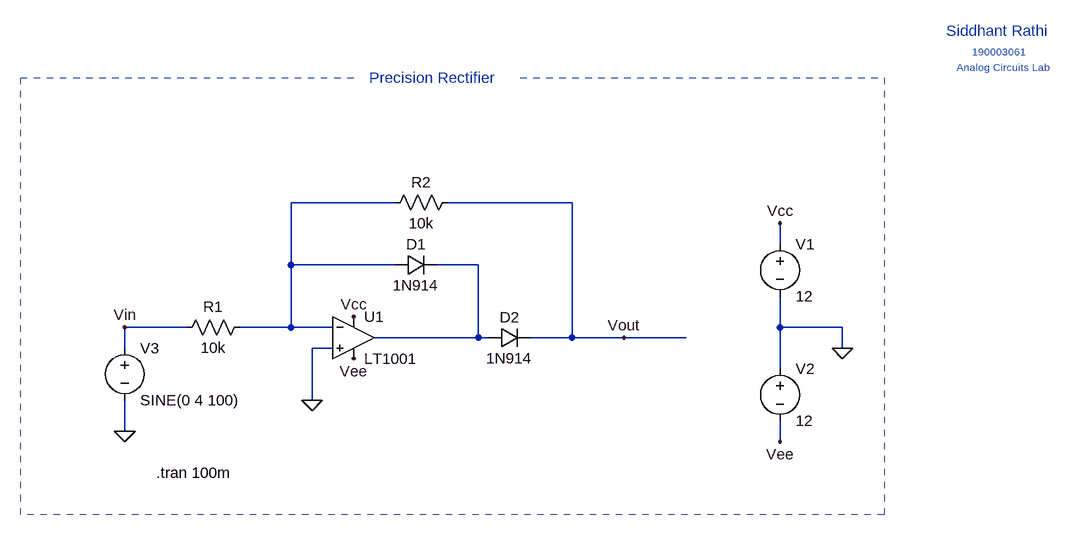
[diagram p0: schematic PrecisionRectifier.asc]
PrecisionRectifier.asc, the LTspice schematic file:
Version 4
SHEET 1 1780 680
WIRE 320 80 160 80
WIRE 592 80 400 80
WIRE 912 144 912 112
WIRE 160 176 160 80
WIRE 320 176 160 176
WIRE 448 176 384 176
WIRE 0 272 -96 272
WIRE 160 272 160 176
WIRE 160 272 80 272
WIRE 224 272 160 272
WIRE 912 272 912 224
WIRE 1008 272 912 272
WIRE 448 288 448 176
WIRE 448 288 288 288
WIRE 464 288 448 288
WIRE 592 288 592 80
WIRE 592 288 528 288
WIRE 672 288 592 288
WIRE 768 288 672 288
WIRE -96 304 -96 272
WIRE 224 304 192 304
WIRE 1008 304 1008 272
WIRE 912 336 912 272
WIRE 192 384 192 304
WIRE -96 432 -96 384
WIRE 912 448 912 416
FLAG -96 432 0
FLAG 1008 304 0
FLAG 912 112 Vcc
FLAG 256 256 Vcc
FLAG 912 448 Vee
FLAG 256 320 Vee
FLAG -96 272 Vin
FLAG 672 288 Vout
FLAG 192 384 0
SYMBOL OpAmps\\LT1001 256 224 R0
SYMATTR InstName U1
SYMBOL voltage 912 128 R0
WINDOW 123 0 0 Left 0
WINDOW 39 0 0 Left 0
SYMATTR InstName V1
SYMATTR Value 12
SYMBOL voltage 912 320 R0
WINDOW 123 0 0 Left 0
WINDOW 39 0 0 Left 0
SYMATTR InstName V2
SYMATTR Value 12
SYMBOL res 416 64 R90
WINDOW 0 0 56 VBottom 2
WINDOW 3 32 56 VTop 2
SYMATTR InstName R2
SYMATTR Value 10k
SYMBOL res 96 256 R90
WINDOW 0 0 56 VBottom 2
WINDOW 3 32 56 VTop 2
SYMATTR InstName R1
SYMATTR Value 10k
SYMBOL voltage -96 288 R0
WINDOW 123 0 0 Left 0
WINDOW 39 0 0 Left 0
SYMATTR InstName V3
SYMATTR Value SINE(0 4 100)
SYMBOL diode 320 192 R270
WINDOW 0 32 32 VTop 2
WINDOW 3 0 32 VBottom 2
SYMATTR InstName D1
SYMATTR Value 1N914
SYMBOL diode 464 304 R270
WINDOW 0 32 32 VTop 2
WINDOW 3 0 32 VBottom 2
SYMATTR InstName D2
SYMATTR Value 1N914
TEXT -48 496 Left 2 !.tran 100m
TEXT 280 -112 Left 2 ;Precision Rectifier
TEXT 1168 -184 Left 2 ;Siddhant Rathi
TEXT 1208 -152 Left 1 ;190003061
TEXT 1184 -128 Left 1 ;Analog Circuits Lab
LINE Normal -256 -112 256 -112 2
LINE Normal -256 560 -256 -112 2
LINE Normal 1072 560 -256 560 2
LINE Normal 1072 -112 1072 560 2
LINE Normal 512 -112 1072 -112 2

The netlist it stands for:
* PrecisionRectifier.asc
XU1 0 N001 Vcc Vee N002 LT1001  ; pins In+ In- V+ V- OUT
V1 Vcc 0 12
V2 0 Vee 12
R2 Vout N001 10k
R1 N001 Vin 10k
V3 Vin 0 SINE(0 4 100)
D1 N001 N002 1N914
D2 N002 Vout 1N914
.model D D
.lib standard.dio
.tran 100m
* Precision Rectifier
* Siddhant Rathi
* 190003061
* Analog Circuits Lab
.lib LTC.lib
.backanno
.end